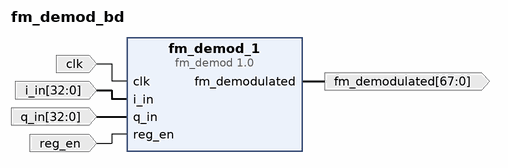
[diagram p0: block diagram of the top level]
# Vivado block design fm_demod_bd, xc7s50csga324-2, Vivado 2018.3
create_bd_design fm_demod_bd

create_bd_port -dir I -type clk clk
create_bd_port -dir O -from 67 -to 0 -type data fm_demodulated
create_bd_port -dir I -from 32 -to 0 -type data i_in
create_bd_port -dir I -from 32 -to 0 -type data q_in
create_bd_port -dir I -type data reg_en

create_bd_cell -type ip -vlnv User_Company:SysGen:fm_demod:1.0 fm_demod_1

# ---- connections ----

connect_bd_net [get_bd_ports clk] [get_bd_pins fm_demod_1/clk]
connect_bd_net [get_bd_pins fm_demod_1/fm_demodulated] [get_bd_ports fm_demodulated]
connect_bd_net [get_bd_ports i_in] [get_bd_pins fm_demod_1/i_in]
connect_bd_net [get_bd_ports q_in] [get_bd_pins fm_demod_1/q_in]
connect_bd_net [get_bd_ports reg_en] [get_bd_pins fm_demod_1/reg_en]

validate_bd_design
save_bd_design
